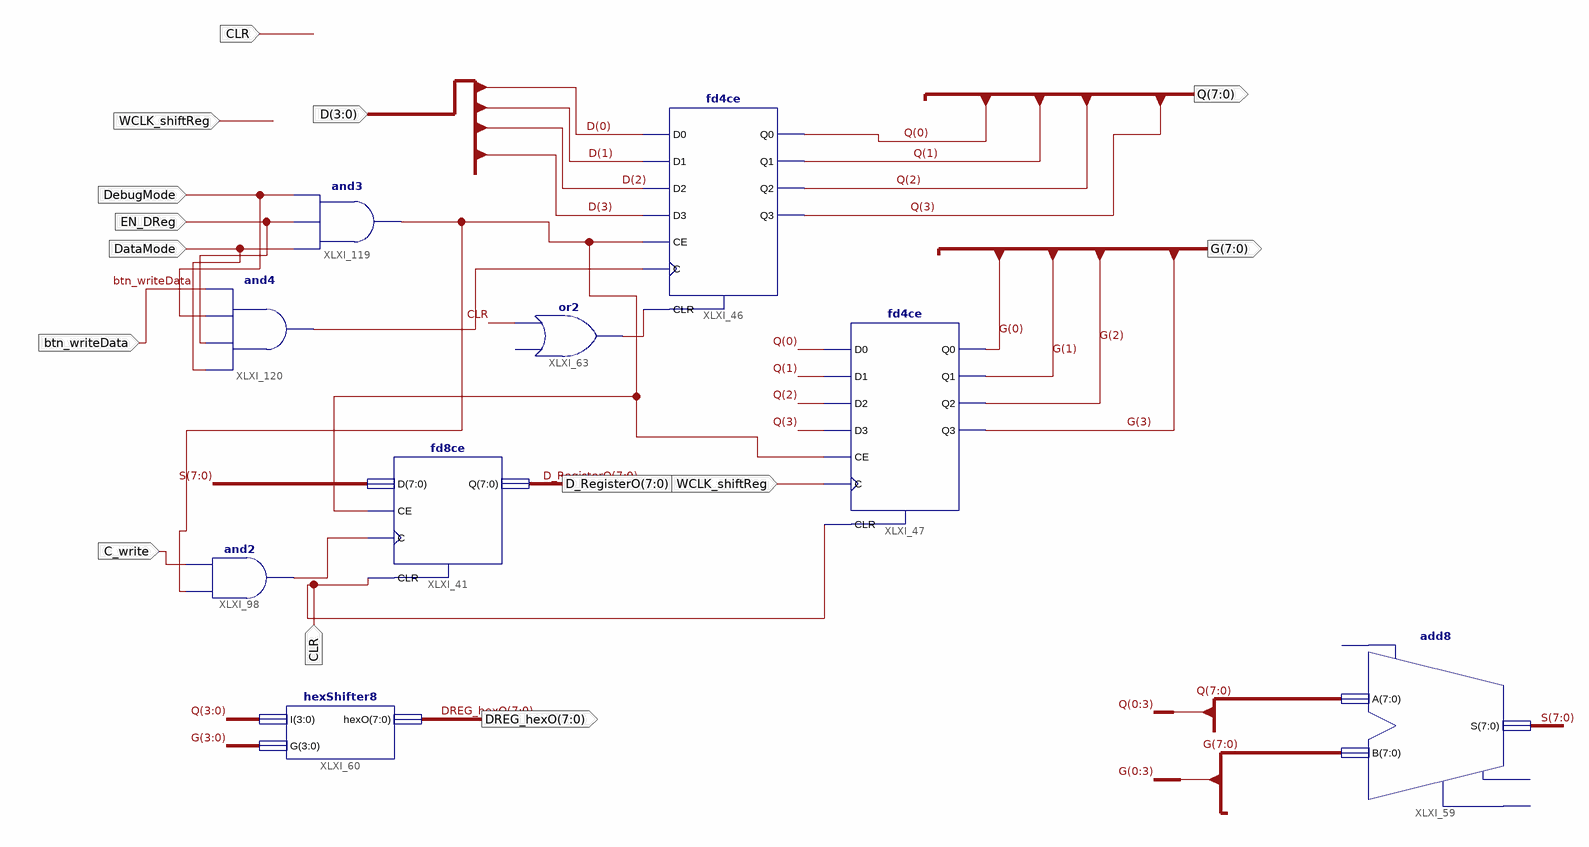
[diagram p0: schematic sheet 1]
// Xilinx ISE schematic D_Register.sch (spartan3e) as structural Verilog: 9 symbols, 12 ports
module D_Register (
  input  [3:0] D,
  input  CLR,
  input  WCLK_shiftReg,
  input  EN_DReg,
  input  DebugMode,
  input  DataMode,
  input  btn_writeData,
  input  C_write,
  output [7:0] Q,
  output [7:0] G,
  output [7:0] D_RegisterO,
  output [7:0] DREG_hexO
);

  wire XLXN_313, XLXN_352, XLXN_355, XLXN_356;
  wire [7:0] S;

  fd4ce XLXI_46 (
    .C(XLXN_352), .CE(XLXN_356), .CLR(XLXN_313), .D0(D[0]), .D1(D[1]), .D2(D[2]), .D3(D[3]), .Q0(Q[0]),
    .Q1(Q[1]), .Q2(Q[2]), .Q3(Q[3]));
  fd4ce XLXI_47 (
    .C(WCLK_shiftReg), .CE(XLXN_356), .CLR(CLR), .D0(Q[0]), .D1(Q[1]), .D2(Q[2]), .D3(Q[3]), .Q0(G[0]),
    .Q1(G[1]), .Q2(G[2]), .Q3(G[3]));
  add8 XLXI_59 (.A(Q), .B(G), .S(S));  // open: CI, CO, OFL
  buf XLXI_63 (XLXN_313, CLR);  // or2 open: I0
  fd8ce XLXI_41 (.C(XLXN_355), .CE(XLXN_356), .CLR(CLR), .D(S), .Q(D_RegisterO));
  hexShifter8 XLXI_60 (.I(Q[3:0]), .G(G[3:0]), .hexO(DREG_hexO));
  and XLXI_119 (XLXN_356, DataMode, EN_DReg, DebugMode);
  and XLXI_120 (XLXN_352, DataMode, EN_DReg, DebugMode, btn_writeData);
  and XLXI_98 (XLXN_355, XLXN_356, C_write);
endmodule
